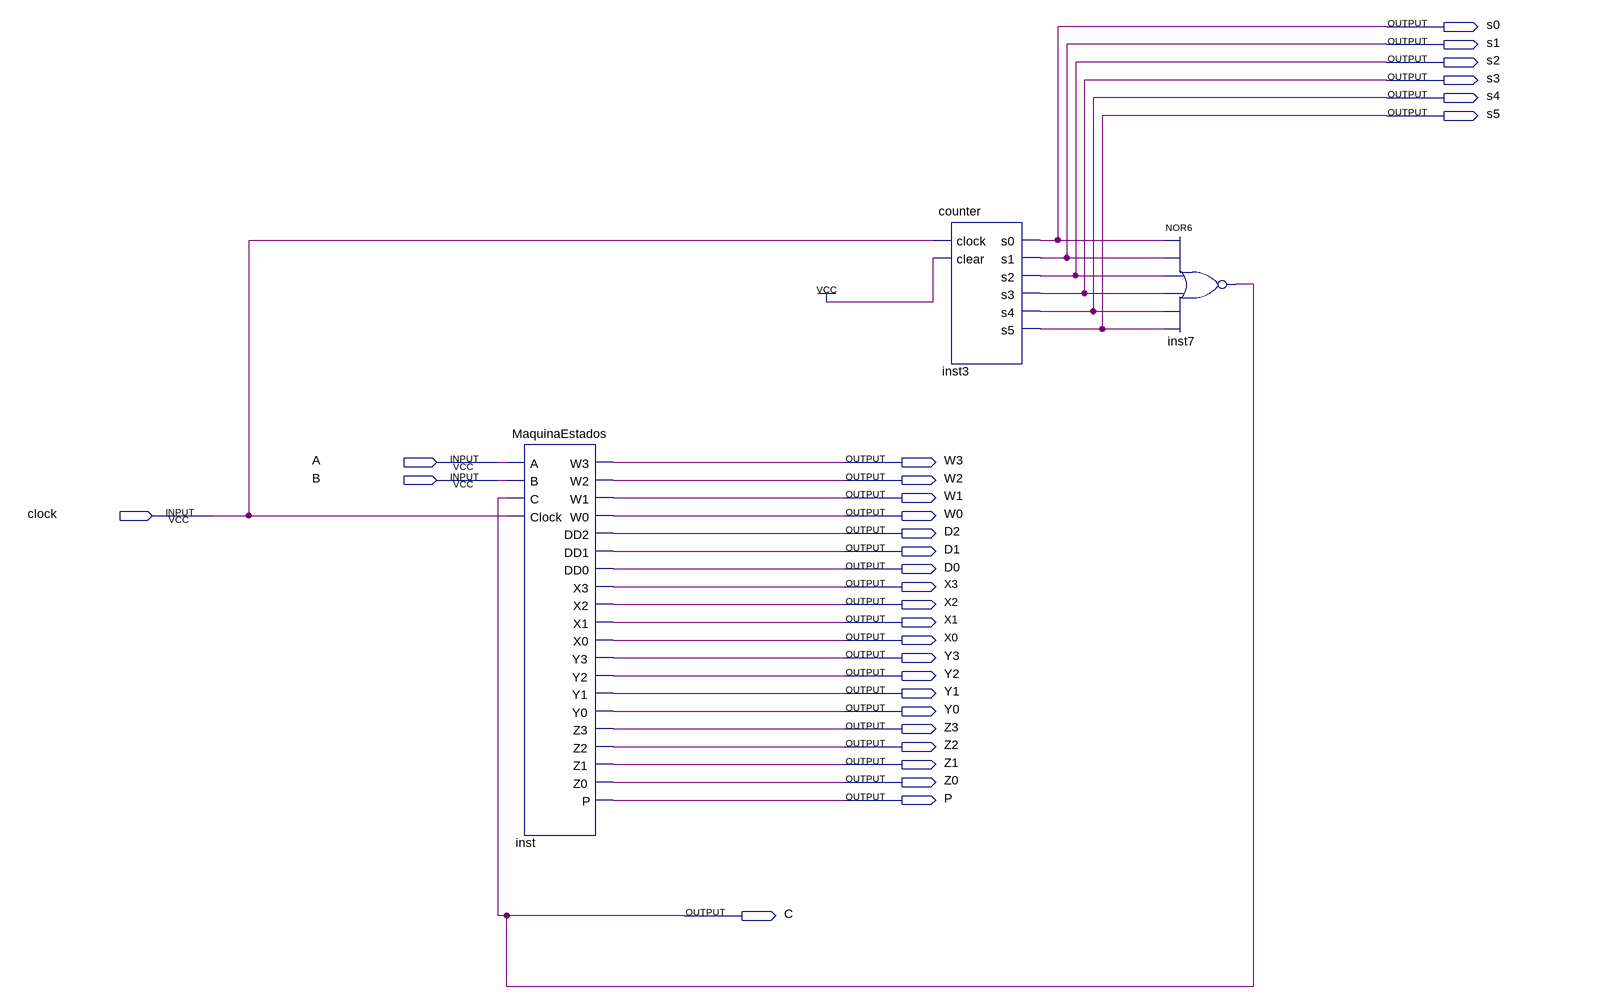
[diagram p0: schematic sheet]
// Quartus schematic gimnasio.bdf as structural Verilog: 3 symbols, 30 pins
module gimnasio (
  input  A,
  input  B,
  input  clock,
  output s0,
  output s1,
  output s2,
  output s3,
  output s4,
  output s5,
  output W3,
  output W2,
  output W1,
  output W0,
  output D2,
  output D1,
  output D0,
  output X3,
  output X2,
  output X1,
  output X0,
  output Y3,
  output Y2,
  output Y1,
  output Y0,
  output Z3,
  output Z2,
  output Z1,
  output Z0,
  output P,
  output C
);

  MaquinaEstados inst (
    .A(A), .B(B), .C(C), .Clock(clock), .W3(W3), .W2(W2), .W1(W1), .W0(W0), .DD2(D2), .DD1(D1), .DD0(D0),
    .X3(X3), .X2(X2), .X1(X1), .X0(X0), .Y3(Y3), .Y2(Y2), .Y1(Y1), .Y0(Y0), .Z3(Z3), .Z2(Z2), .Z1(Z1),
    .Z0(Z0), .P(P));
  counter inst3 (.clock(clock), .clear(1'b1), .s0(s0), .s1(s1), .s2(s2), .s3(s3), .s4(s4), .s5(s5));
  nor inst7 (C, s0, s1, s2, s3, s4, s5);
endmodule
